# EAGLE design M502 (EAGLE 4.11)
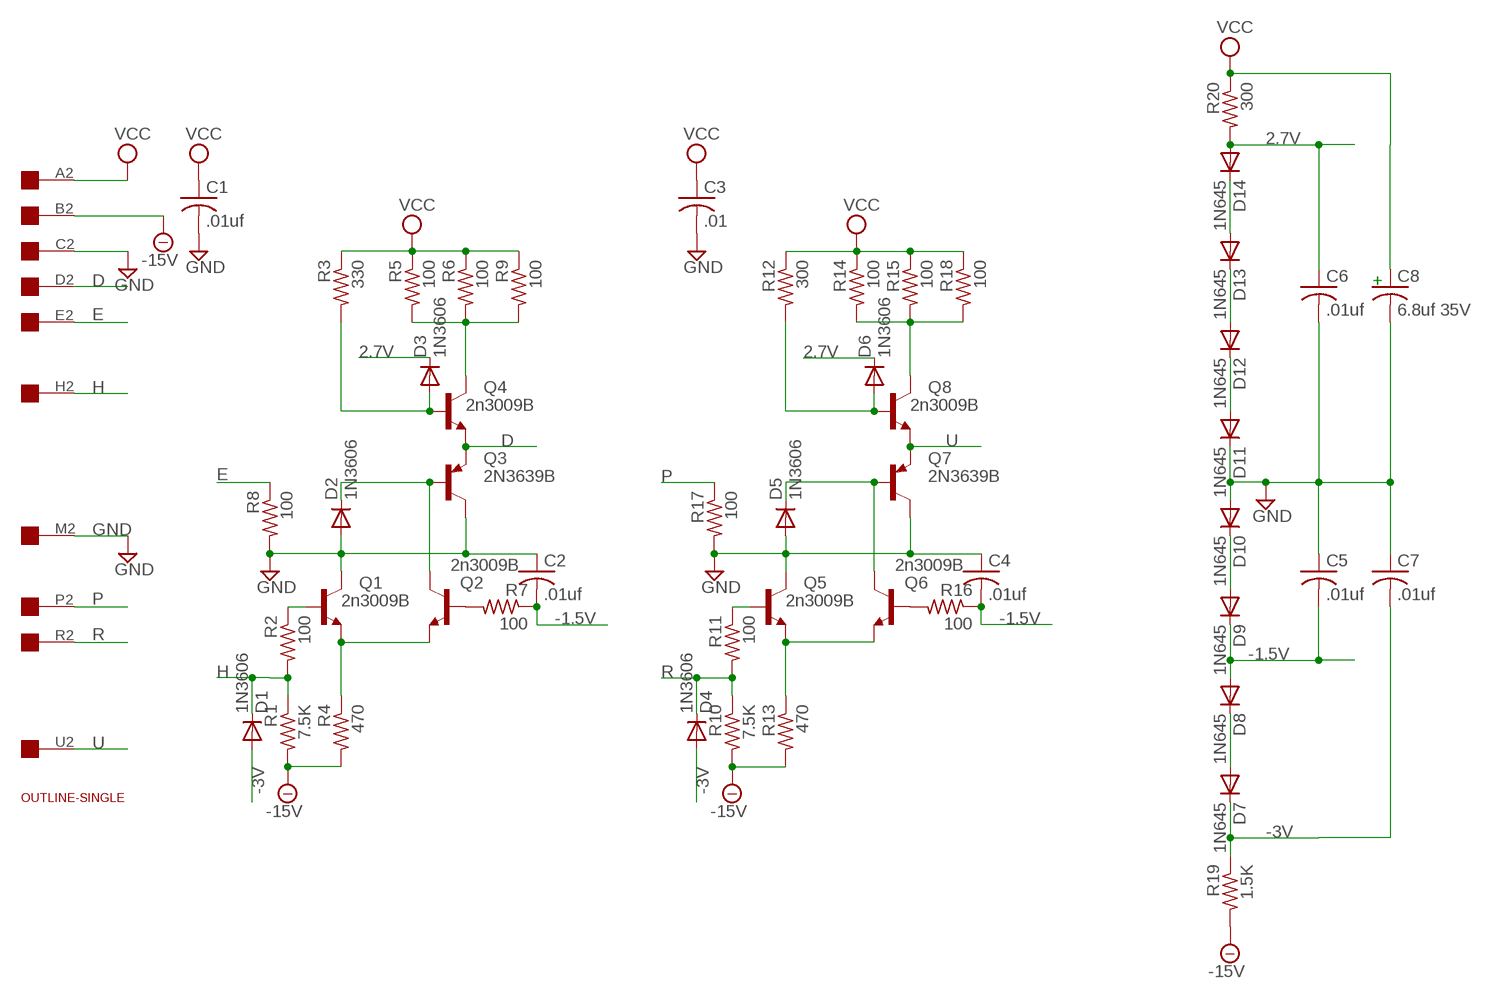
[diagram p0: schematic, sheet 1]

## Parts
C1  .01uf  C-US050-025X075  [C050-025X075]
C2  .01uf  C-US050-025X075  [C050-025X075]
C3  .01  C-US050-025X075  [C050-025X075]
C4  .01uf  C-US050-025X075  [C050-025X075]
C5  .01uf  C-US050-025X075  [C050-025X075]
C6  .01uf  C-US050-025X075  [C050-025X075]
C7  .01uf  C-US050-025X075  [C050-025X075]
C8  6.8uf 35V  C-US102-043X133  [C102-043X133]
D1  1N3606  1N4004  [DO41-10]
D2  1N3606  1N4004  [DO41-10]
D3  1N3606  1N4004  [DO41-10]
D4  1N3606  1N4004  [DO41-10]
D5  1N3606  1N4004  [DO41-10]
D6  1N3606  1N4004  [DO41-10]
D7  1N645  1N4004  [DO41-10]
D8  1N645  1N4004  [DO41-10]
D9  1N645  1N4004  [DO41-10]
D10  1N645  1N4004  [DO41-10]
D11  1N645  1N4004  [DO41-10]
D12  1N645  1N4004  [DO41-10]
D13  1N645  1N4004  [DO41-10]
D14  1N645  1N4004  [DO41-10]
Q1  2n3009B  2N1711  [TO39]
Q2  2n3009B  2N1711  [TO39]
Q3  2N3639B  2N5415  [TO39]
Q4  2n3009B  2N1711  [TO39]
Q5  2n3009B  2N1711  [TO39]
Q6  2n3009B  2N1711  [TO39]
Q7  2N3639B  2N5415  [TO39]
Q8  2n3009B  2N1711  [TO39]
R1  7.5K  R-US_0207/10  [0207/10]
R2  100  R-US_0207/10  [0207/10]
R3  330  R-US_0207/10  [0207/10]
R4  470  R-US_0207/10  [0207/10]
R5  100  R-US_0207/10  [0207/10]
R6  100  R-US_0207/10  [0207/10]
R7  100  R-US_0207/10  [0207/10]
R8  100  R-US_0207/10  [0207/10]
R9  100  R-US_0207/10  [0207/10]
R10  7.5K  R-US_0207/10  [0207/10]
R11  100  R-US_0207/10  [0207/10]
R12  300  R-US_0207/10  [0207/10]
R13  470  R-US_0207/10  [0207/10]
R14  100  R-US_0207/10  [0207/10]
R15  100  R-US_0207/10  [0207/10]
R16  100  R-US_0207/10  [0207/10]
R17  100  R-US_0207/10  [0207/10]
R18  100  R-US_0207/10  [0207/10]
R19  1.5K  R-US_0207/10  [0207/10]
R20  300  R-US_0207/10  [0207/10]
U$1  EDGE-1  [EDGE-CON1]
U$2  OUTLINE-SINGLE  [SINGLE]

## Nets
2.7V: C6.1 D3.C D6.C D14.A R20.2
-1.5V: C2.2 C4.2 C5.2 D8.A D9.C R7.1 R16.1
-3V: C7.2 D1.A D4.A D7.C R19.1
-15V: R1.2 R4.2 R10.2 R13.2 R19.2 U$1.B2
D: Q3.1(E) Q4.1(E) U$1.D2
E: R8.1 U$1.E2
GND: C1.2 C2.1 C3.2 C4.1 C5.1 C6.2 C7.1 C8.2 D2.A D5.A D10.A D11.C Q1.3(C) Q3.3(C) Q5.3(C) Q7.3(C) R8.2 R17.2 U$1.C2 U$1.M2
H: D1.C R1.1 R2.2 U$1.H2
N$1: Q4.3(C) R5.2 R6.2 R9.2
N$2: Q1.2(B) R2.1
N$3: Q5.1(E) Q6.1(E) R13.1
N$4: Q1.1(E) Q2.1(E) R4.1
N$6: D11.A D12.C
N$7: D2.C Q2.3(C) Q3.2(B)
N$8: D3.A Q4.2(B) R3.2
N$9: D7.A D8.C
N$10: Q5.2(B) R11.1
N$11: D5.C Q6.3(C) Q7.2(B)
N$12: Q2.2(B) R7.2
N$13: D12.A D13.C
N$14: D9.A D10.C
N$15: Q8.3(C) R14.2 R15.2 R18.2
N$17: D13.A D14.C
N$18: D6.A Q8.2(B) R12.2
N$19: Q6.2(B) R16.2
P: R17.1 U$1.P2
R: D4.C R10.1 R11.2 U$1.R2
U: Q7.1(E) Q8.1(E) U$1.U2
VCC: C1.1 C3.1 C8.1 R3.1 R5.1 R6.1 R9.1 R12.1 R14.1 R15.1 R18.1 R20.1 U$1.A2
Unconnected: U$1.F2 U$1.J2 U$1.K2 U$1.L2 U$1.N2 U$1.S2 U$1.T2 U$1.V2

## Notes on the sheet
- +

## Library data of the parts
C1-C8 = rcl:C-US: CAPACITOR, American symbol
D1-D14 = diode:1N4004: DIODE general purpose rectifier, 1 A
Q1 Q2 Q4-Q6 Q8 = transistor-npn:2N1711: NPN Transistor
Q3 Q7 = transistor-pnp:2N5415*: PNP Transistror
R1-R20 = rcl:R-US_: RESISTOR, American symbol
U$1 = dec-con:EDGE-1: Single-Sided DEC Edge Connector -- (side 2)
U$2 = dec-con:OUTLINE-*: Board outlines for DEC boards.

## Board
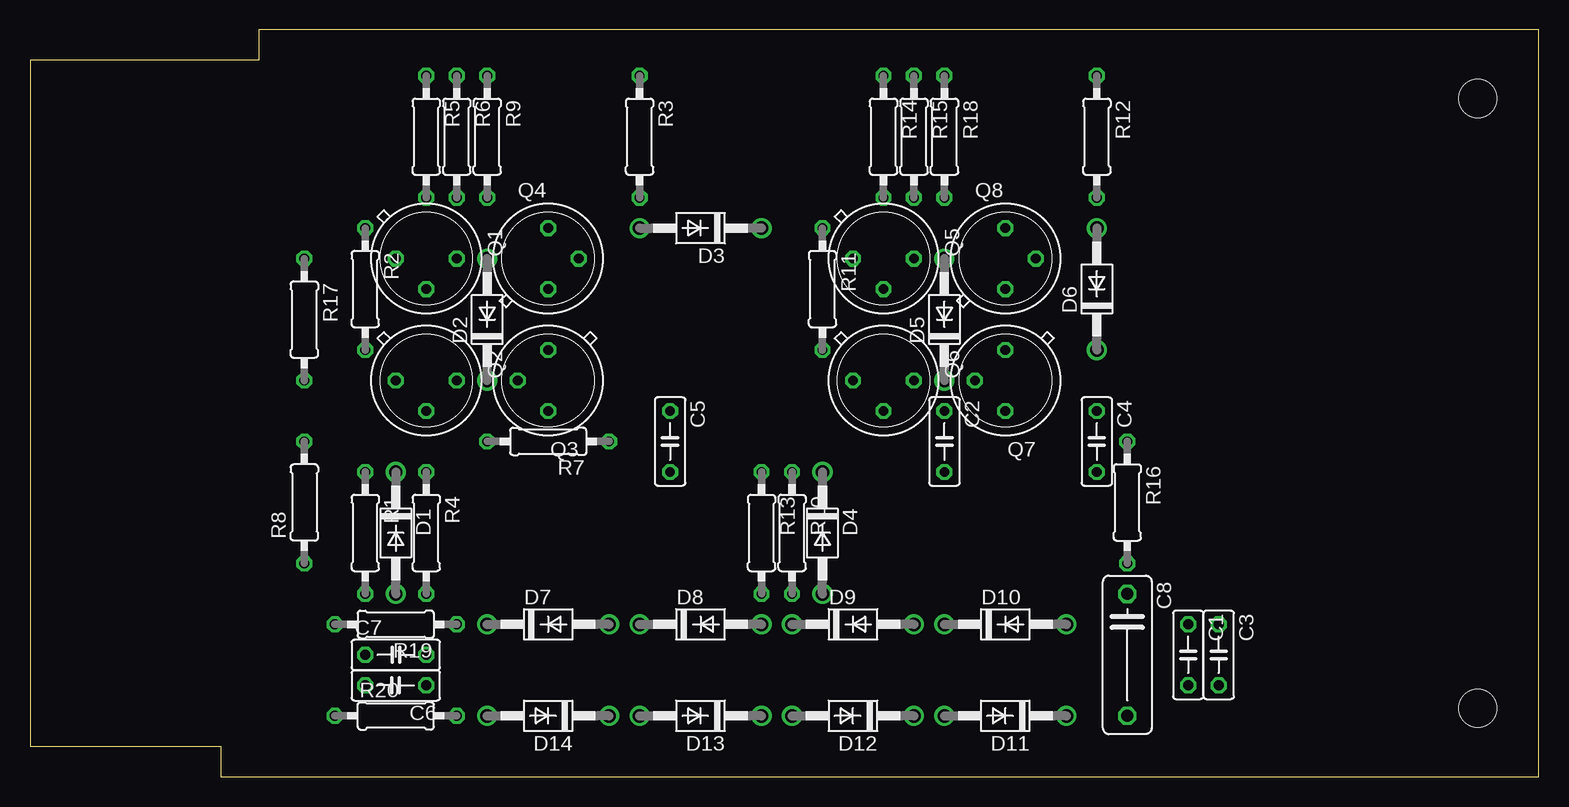
[diagram p1: board, top side]
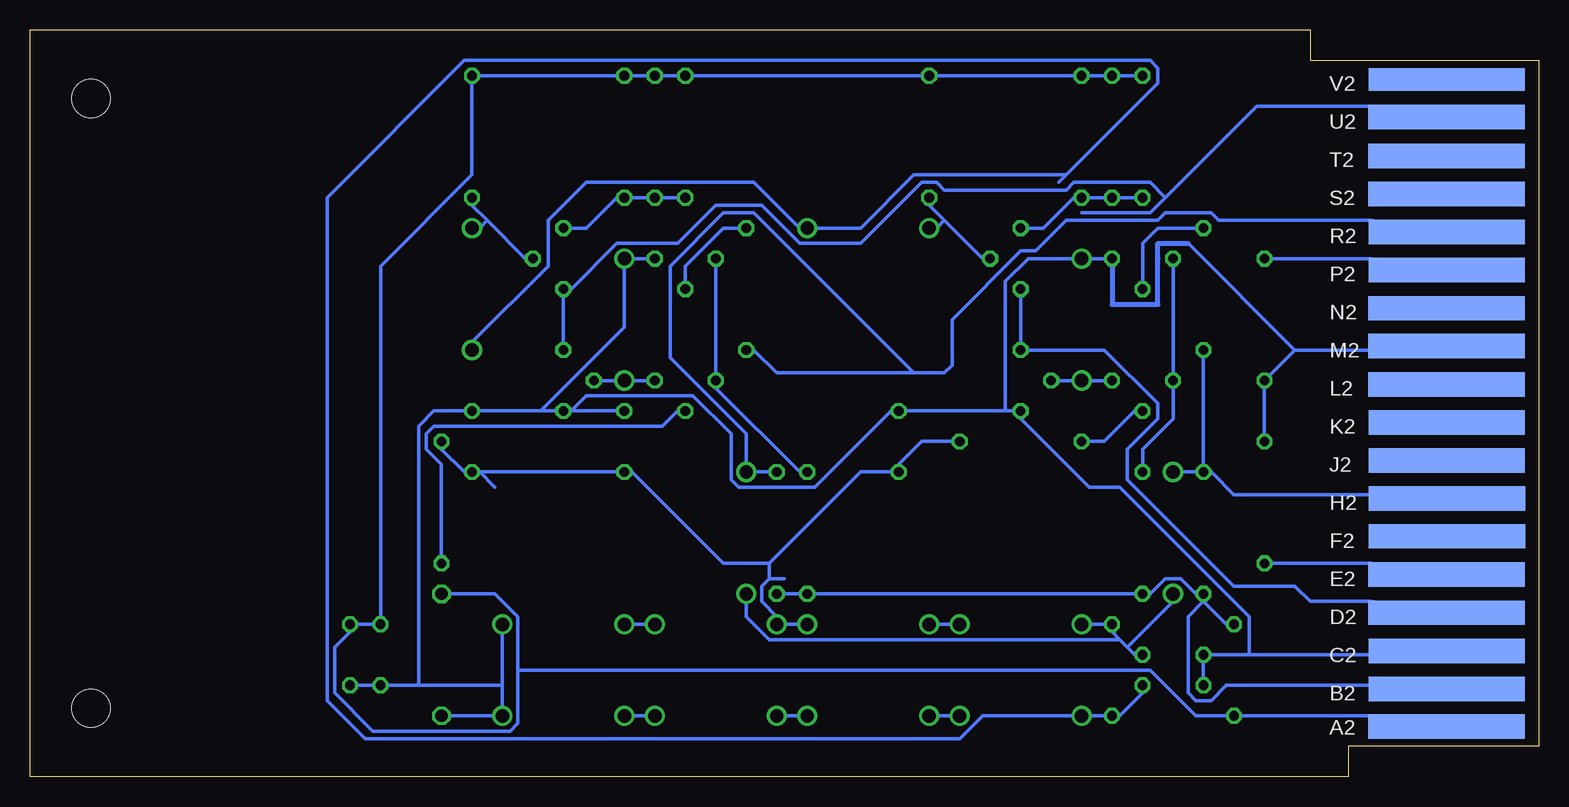
[diagram p2: board, bottom side, seen from below]

Size 125.73 x 62.23 mm. Coordinates in mm from the lower left corner, seen from the top.
Copper layers (1*16): Top 0.035mm / dielectric 1.5mm / Bottom 0.035mm
Design rules "10mils": minimum track width 12mil, minimum drill 28mil, track to track 10mil, track to pad 10mil, pad to pad 10mil, via to via 10mil, smd to smd 10mil, copper to edge 40mil, drill to drill 10mil, minimum pad ring 10mil, minimum via ring 8mil, stop-mask expansion 0mil, vias tented up to drill 0mil, thermal gap 10mil

### Footprints (pad centres in the part's own frame; a part is rotated, then mirrored left to right if it is on the bottom)
C050-025X075 = drill 0.813 octagon: 1 -2.54,0; 2 2.54,0
C102-043X133 = drill 1.016 octagon: 1 -5.08,0; 2 5.08,0
DO41-10 = drill 1.118 round: A 5.08,0; C -5.08,0
TO39 = drill 0.813 octagon: 1 0,-2.54; 2 2.54,0; 3 0,2.54
0207/10 = drill 0.813 octagon: 1 -5.08,0; 2 5.08,0
EDGE-CON1 = smd 13.017 x 2.032 bottom: A2 7.69,4.194; B2 7.668,7.328; C2 7.668,10.49; D2 7.693,13.665; E2 7.693,16.84; F2 7.642,20.041; H2 7.642,23.19; J2 7.668,26.34; K2 7.668,29.515; L2 7.693,32.69; M2 7.693,35.89; N2 7.693,39.04; P2 7.668,42.24; R2 7.668,45.39; S2 7.693,48.565; T2 7.693,51.74; U2 7.693,54.966 | smd 13.017 x 1.905 bottom: V2 7.668,58.102
SINGLE = hole 3.175: 120.65,56.515; 120.65,5.715

### Placement (x,y rotation side)
C1  96.52,10.16 270 top
C2  76.2,27.94 270 top
C3  99.06,10.16 270 top
C4  88.9,27.94 270 top
C5  53.34,27.94 270 top
C6  30.48,7.62 180 top
C7  30.48,10.16 0 top
C8  91.44,10.16 270 top
D1  30.48,20.32 270 top
D2  38.1,38.1 90 top
D3  55.88,45.72 180 top
D4  66.04,20.32 270 top
D5  76.2,38.1 90 top
D6  88.9,40.64 90 top
D7  43.18,12.7 0 top
D8  55.88,12.7 0 top
D9  68.58,12.7 0 top
D10  81.28,12.7 0 top
D11  81.28,5.08 180 top
D12  68.58,5.08 180 top
D13  55.88,5.08 180 top
D14  43.18,5.08 180 top
Q1  33.02,43.18 270 top
Q2  33.02,33.02 270 top
Q3  43.18,33.02 180 top
Q4  43.18,43.18 0 top
Q5  71.12,43.18 270 top
Q6  71.12,33.02 270 top
Q7  81.28,33.02 180 top
Q8  81.28,43.18 0 top
R1  27.94,20.32 270 top
R2  27.94,40.64 270 top
R3  50.8,53.34 270 top
R4  33.02,20.32 270 top
R5  33.02,53.34 270 top
R6  35.56,53.34 270 top
R7  43.18,27.94 180 top
R8  22.86,22.86 90 top
R9  38.1,53.34 270 top
R10  63.5,20.32 270 top
R11  66.04,40.64 270 top
R12  88.9,53.34 270 top
R13  60.96,20.32 270 top
R14  71.12,53.34 270 top
R15  73.66,53.34 270 top
R16  91.44,22.86 270 top
R17  22.86,38.1 270 top
R18  76.2,53.34 270 top
R19  30.48,12.7 180 top
R20  30.48,5.08 0 top
U$1  0,0 0 top
U$2  0,0 0 top

### Tracks (layer width: path | path; a pad name or v marks a point on that pad's centre or on a via)
2.7V
  Bottom 0.305: C6.1 33.02,6.99 34.93,5.08 R20.2 36.2,5.08 37.47,5.08 D14.A 38.74,5.08 46.36,5.08 48.26,3.17 97.79,3.17 100.97,6.35 100.97,48.26 89.54,59.69 32.39,59.69 31.75,59.05 31.75,57.78 39.37,50.16 | D6.C 88.9,36.2 82.55,42.55 82.55,46.35 79.38,49.53 65.41,49.53 61.6,45.72 D3.C 60.33,45.72 56.52,45.72 52.07,50.16 39.37,50.16 | 39.37,50.16 40.01,49.53
-1.5V
  Bottom 0.305: 64.14,16.51 62.87,16.51 | 64.14,16.51 64.77,15.88 64.77,14.61 63.5,13.34 D9.C 62.87,12.7 61.6,12.7 D8.A | R7.1 48.9,27.94 51.44,27.94 53.34,26.04 C5.2 53.98,25.4 55.25,25.4 56.52,25.4 64.14,17.78 | C4.2 89.54,25.4 91.44,27.3 R16.1 | 88.27,25.4 87,24.13 | 88.27,25.4 C4.2 | 64.14,16.51 64.14,17.78 | 88.27,25.4 76.84,25.4 C2.2 75.57,25.4 67.95,17.78 64.14,17.78 | 88.27,25.4 C4.2
-3V
  Bottom 0.305: 34.93,11.43 35.56,12.06 R19.1 36.2,12.7 37.47,12.7 D7.C | 34.29,10.79 34.93,11.43 | 34.29,10.79 33.66,10.16 C7.2 | 34.29,10.79 30.48,14.61 D1.A | 34.93,11.43 64.14,11.43 66.04,13.34 66.04,14.61 D4.A
-15V
  Bottom 0.305: 27.94,14.61 29.21,13.34 29.21,6.99 28.58,6.35 27.31,6.35 26.04,7.62 20.32,7.62 13.97,7.62 U$1.B2 | 27.94,14.61 R1.2 | 27.94,14.61 26.04,12.7 R19.2 | 27.94,14.61 R1.2 | 60.33,15.24 36.2,15.24 34.93,15.24 33.66,15.24 R4.2 32.39,15.24 31.12,16.51 29.85,16.51 28.58,15.24 R1.2 | 60.33,15.24 R13.2 | R13.2 62.87,15.24 R10.2 | 60.33,15.24 R13.2
D
  Bottom 0.305: Q4.1 43.18,40.01 43.18,36.2 Q3.1 42.55,35.56 36.2,35.56 31.75,31.11 31.75,29.84 34.29,27.3 34.29,24.77 25.4,15.88 20.32,15.88 19.05,14.61 13.97,14.61 U$1.D2
E
  Bottom 0.305: R8.1 22.23,17.78 20.32,17.78 13.97,17.78 U$1.E2
GND
  Bottom 0.305: Q5.3 74.3,43.18 75.57,43.18 D5.A 76.2,42.55 76.2,37.47 83.19,30.48 | 83.19,30.48 88.27,30.48 C4.1 89.54,30.48 92.08,30.48 93.35,29.21 93.35,7.62 | 83.19,30.48 81.92,30.48 Q7.3 | C3.2 98.43,7.62 97.16,7.62 C1.2 95.89,7.62 93.35,7.62 | C8.2 90.81,5.08 87,5.08 D11.C 86.36,5.71 86.36,7.62 | R8.2 22.86,28.57 22.86,32.38 R17.2 20.32,35.56 | Q1.3 36.2,43.18 37.47,43.18 D2.A 38.74,43.18 42.55,43.18 44.45,41.27 44.45,30.48 | C6.2 27.94,8.26 27.94,9.53 C7.1 27.31,10.16 24.13,10.16 | 24.13,10.16 20.32,10.16 13.97,10.16 U$1.C2 | 29.21,44.45 20.32,35.56 | 44.45,30.48 43.82,30.48 Q3.3 43.18,29.84 37.47,24.13 34.93,24.13 24.13,13.34 24.13,10.16 | 44.45,30.48 52.71,30.48 C5.1 53.98,30.48 60.33,24.13 66.68,24.13 67.31,24.77 67.31,28.57 70.49,31.75 79.38,31.75 80.65,30.48 | 86.36,7.62 86.36,12.06 D10.A | 93.35,7.62 86.36,7.62 | 80.65,30.48 76.84,30.48 C2.1 | 80.65,30.48 Q7.3 | 80.65,30.48 Q7.3 | 20.32,35.56 13.97,35.56 U$1.M2
  Bottom 0.406: Q1.3 35.56,39.37 31.75,39.37 31.75,43.18 31.75,44.45 29.21,44.45
H
  Bottom 0.305: R1.1 27.31,25.4 25.4,23.5 20.32,23.5 13.97,23.5 U$1.H2 | R2.2 27.94,34.92 27.94,26.04 R1.1 | D1.C 29.85,25.4 28.58,25.4 R1.1
N$1
  Bottom 0.305: R5.2 33.66,48.26 34.93,48.26 R6.2 36.2,48.26 37.47,48.26 R9.2 38.74,48.26 41.28,45.72 42.55,45.72 Q4.3
N$2
  Bottom 0.305: R2.1 28.58,45.72 31.75,45.72 33.02,44.45 33.02,41.27 Q1.2
N$3
  Bottom 0.305: Q5.1 68.58,42.55 68.58,33.66 Q6.1 68.58,32.38 61.6,25.4 R13.1
N$4
  Bottom 0.305: Q1.1 30.48,42.55 30.48,33.66 Q2.1 30.48,32.38 30.48,29.84 33.02,27.3 33.02,26.04 R4.1
N$6
  Bottom 0.305: D12.C 74.3,5.08 75.57,5.08 D11.A
N$7
  Bottom 0.305: Q2.3 36.2,33.02 37.47,33.02 D2.C 38.74,33.02 40.01,33.02 Q3.2
N$8
  Bottom 0.305: 49.53,46.35 50.8,47.62 R3.2 | 49.53,46.35 46.36,43.18 Q4.2 | 49.53,46.35 50.17,45.72 D3.A
N$9
  Bottom 0.305: D7.A 48.9,12.7 50.17,12.7 D8.C
N$10
  Bottom 0.305: R11.1 66.68,45.72 67.95,45.72 71.12,42.55 71.12,41.27 Q5.2
N$11
  Bottom 0.305: Q6.3 74.3,33.02 75.57,33.02 D5.C 76.84,33.02 78.11,33.02 Q7.2
N$12
  Bottom 0.305: R7.2 37.47,27.94 36.2,27.94 33.66,30.48 Q2.2
N$13
  Bottom 0.305: D13.C 61.6,5.08 62.87,5.08 D12.A
N$14
  Bottom 0.305: D9.A 74.3,12.7 75.57,12.7 D10.C
N$15
  Bottom 0.305: R14.2 71.76,48.26 73.03,48.26 R15.2 74.3,48.26 75.57,48.26 R18.2 76.84,48.26 79.38,45.72 80.65,45.72 Q8.3
N$17
  Bottom 0.305: D14.C 48.9,5.08 50.17,5.08 D13.A
N$18
  Bottom 0.305: 87.63,46.35 88.9,47.62 R12.2 | 87.63,46.35 84.46,43.18 Q8.2 | 87.63,46.35 88.27,45.72 D6.A
N$19
  Bottom 0.305: R16.2 91.44,18.41 91.44,26.04 92.71,27.3 92.71,28.57 92.08,29.21 73.03,29.21 71.76,30.48 Q6.2
P
  Bottom 0.305: R17.1 22.23,43.18 20.32,43.18 13.97,43.18 U$1.P2
R
  Bottom 0.305: R10.1 64.14,25.4 65.41,25.4 D4.C 66.04,26.04 66.04,28.57 72.39,34.92 72.39,42.55 67.95,46.99 65.41,46.99 52.07,33.66 | 52.07,33.66 63.5,33.66 65.41,35.56 R11.2 | 52.07,33.66 49.53,33.66 48.9,34.29 48.9,36.83 48.9,38.1 43.18,43.81 41.91,43.81 39.37,46.35 37.47,46.35 31.75,46.35 31.12,46.99 29.85,46.99 27.31,46.99 26.67,46.35 20.32,46.35 13.97,46.35 U$1.R2
U
  Bottom 0.305: Q7.1 81.28,36.2 81.28,40.01 Q8.1 80.65,40.64 76.84,44.45 71.76,44.45 68.58,47.62 64.77,47.62 61.6,44.45 56.52,44.45 51.44,49.53 50.17,49.53 49.53,48.9 39.37,48.9 38.74,49.53 32.39,49.53 31.12,48.26 | 31.12,48.26 23.5,55.88 20.32,55.88 13.97,55.88 U$1.U2 | 31.12,48.26 32.39,46.99 38.1,46.99
VCC
  Bottom 0.305: R5.1 33.66,58.42 34.93,58.42 R6.1 36.2,58.42 37.47,58.42 R9.1 38.74,58.42 50.17,58.42 R3.1 51.44,58.42 70.49,58.42 R14.1 71.76,58.42 73.03,58.42 R15.1 74.3,58.42 75.57,58.42 R18.1 76.84,58.42 88.27,58.42 R12.1 88.9,57.78 88.9,50.16 96.52,42.55 96.52,13.34 C1.1 97.16,12.7 98.43,12.7 C3.1 99.06,12.06 100.33,10.79 100.33,6.99 97.16,3.81 85.73,3.81 85.09,4.45 85.09,8.89 | 85.09,8.89 85.09,13.34 87,15.24 90.81,15.24 C8.1 | 85.09,8.89 32.39,8.89 28.58,5.08 26.04,5.08 R20.1 24.77,5.08 20.32,5.08 13.97,5.08 U$1.A2